# EAGLE design audio_spectrum (EAGLE 8.3.1)
AUTHOR: Samuel Rohrer, Joshua Adkins; REV: E; TITLE: AUDIO SPECTRUM MODULE

## Sheet 1 of 2
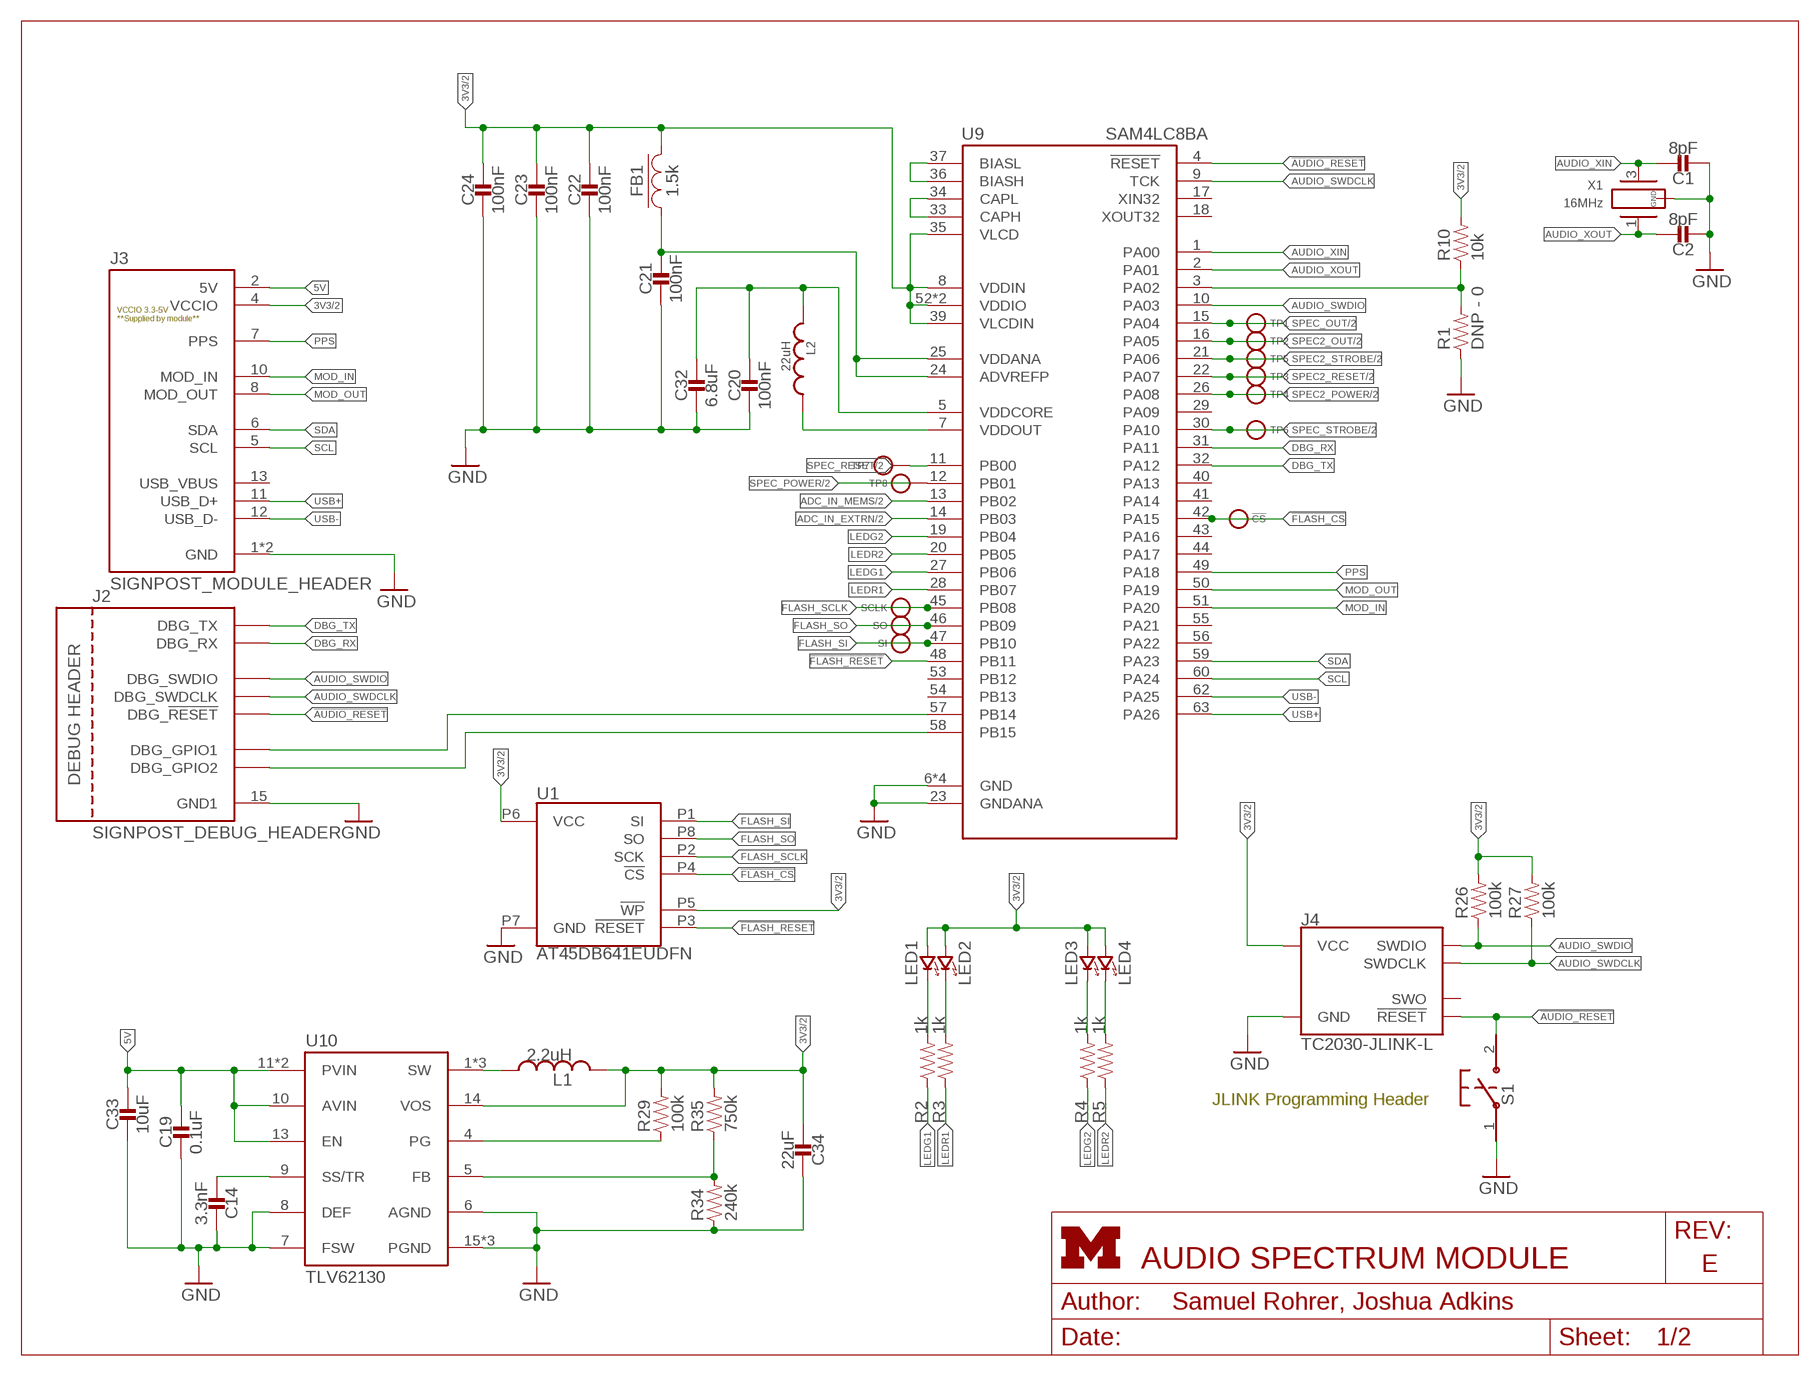
[diagram p0: schematic, sheet 1]
FRAME1 (LETTER_L_UMICH): HEIGHT: 8.5in; WIDTH: 11in

### Parts
!CS  TEST_POINT_0.040IN  [TESTPOINT_0.040IN]
C1  8pF  CAPACITOR0402_CAP  [0402_CAP]
C2  8pF  CAPACITOR0402_CAP  [0402_CAP]
C14  3.3nF  CAPACITOR0603_CAP  [0603_CAP]
C19  0.1uF  CAPACITOR0603_CAP  [0603_CAP]
C20  100nF  CAPACITOR0402_CAP  [0402_CAP]
C21  100nF  CAPACITOR0603_CAP  [0603_CAP]
C22  100nF  CAPACITOR0603_CAP  [0603_CAP]
C23  100nF  CAPACITOR0603_CAP  [0603_CAP]
C24  100nF  CAPACITOR0603_CAP  [0603_CAP]
C32  6.8uF  CAPACITOR0603_CAP  [0603_CAP]
C33  10uF  CAPACITOR0603_CAP  [0603_CAP]
C34  22uF  CAPACITOR0603_CAP  [0603_CAP]
FB1  1.5k  FERRITE_BEAD0402  [0402_CAP]
J2  SIGNPOST_DEBUG_HEADER  [SIGNPOST_DEBUG_HEADER]
J3  SIGNPOST_MODULE_HEADER  [SIGNPOST_MODULE_HEADER]
J4  TC2030-JLINK-L  [TC2030-IDC]
L1  2.2uH  INDUCTORIHL  [IHL-1212BZ-11]
L2  22uH  LHQ3NP  [1212]
LED1  LED0603  [LED-0603]
LED2  LED0603  [LED-0603]
LED3  LED0603  [LED-0603]
LED4  LED0603  [LED-0603]
R1  DNP - 0  RESISTOR0603_RES  [0603-RES]
R2  1k  RESISTOR0603_RES  [0603-RES]
R3  1k  RESISTOR0603_RES  [0603-RES]
R4  1k  RESISTOR0603_RES  [0603-RES]
R5  1k  RESISTOR0603_RES  [0603-RES]
R10  10k  RESISTOR0603_RES  [0603-RES]
R26  100k  RESISTOR0603_RES  [0603-RES]
R27  100k  RESISTOR0603_RES  [0603-RES]
R29  100k  RESISTOR0603_RES  [0603-RES]
R34  240k  RESISTOR0603_RES  [0603-RES]
R35  750k  RESISTOR0603_RES  [0603-RES]
S1  B3U-1000P  [B3U-1000P]
SCLK  TEST_POINT_0.040IN  [TESTPOINT_0.040IN]
SI  TEST_POINT_0.040IN  [TESTPOINT_0.040IN]
SO  TEST_POINT_0.040IN  [TESTPOINT_0.040IN]
TP1  TEST_POINT_0.040IN  [TESTPOINT_0.040IN]
TP2  TEST_POINT_0.040IN  [TESTPOINT_0.040IN]
TP3  TEST_POINT_0.040IN  [TESTPOINT_0.040IN]
TP4  TEST_POINT_0.040IN  [TESTPOINT_0.040IN]
TP5  TEST_POINT_0.040IN  [TESTPOINT_0.040IN]
TP6  TEST_POINT_0.040IN  [TESTPOINT_0.040IN]
TP7  TEST_POINT_0.040IN  [TESTPOINT_0.040IN]
TP8  TEST_POINT_0.040IN  [TESTPOINT_0.040IN]
U1  AT45DB641EUDFN  [UDFN-8-5MMX6MM]
U9  SAM4LC8BA  [QFN-64-9MM]
U10  TLV62130  [TQFN-16/3MM]
X1  16MHz  FH1600015  [FHXXX]

### Nets
3V3: C22.1 C23.1 C24.1 C34.2 FB1.2 J3.4(VCCIO) J4.1(VCC) L1.P$2 LED1.A(ANODE) LED2.A(ANODE) LED3.A(ANODE) LED4.A(ANODE) R10.2 R26.2 R27.2 R29.2 R35.2 U1.P5(!WP) U1.P6(VCC) U9.8(VDDIN) U9.35(VLCD) U9.39(VLCDIN) U9.52(VDDIO) U9.61(VDDIO) U10.14(VOS) ; also sheet 2
3VSWOUT: L1.P$1 U10.1(SW) U10.2(SW) U10.3(SW)
5V: C19.1 C33.1 J3.2(5V) U10.10(AVIN) U10.11(PVIN) U10.12(PVIN) U10.13(EN)
!AUDIO_RESET: J2.20(DBG_!RESET) J4.3(!RESET) S1.2 U9.4(!RESET)
!FLASH_CS: !CS.TESTPOINT U1.P4(!CS) U9.42(PA15)
!FLASH_RESET: U1.P3(!RESET) U9.48(PB11)
ADC_IN_EXTRN: U9.14(PB03) ; also sheet 2
ADC_IN_MEMS: U9.13(PB02) ; also sheet 2
AUDIO_SWDCLK: J2.21(DBG_SWDCLK) J4.4(SWDCLK) R27.1 U9.9(TCK)
AUDIO_SWDIO: J2.22(DBG_SWDIO) J4.2(SWDIO) R26.1 U9.10(PA03)
AUDIO_XIN: C1.1 U9.1(PA00) X1.3
AUDIO_XOUT: C2.1 U9.2(PA01) X1.1
CONTROLLER_BUCK/LDO_N: R1.2 R10.1 U9.3(PA02)
DBG_GPIO1: J2.16(DBG_GPIO1) U9.57(PB14)
DBG_GPIO2: J2.19(DBG_GPIO2) U9.58(PB15)
DBG_RX: J2.18(DBG_RX) U9.31(PA11)
DBG_TX: J2.17(DBG_TX) U9.32(PA12)
FLASH_SCLK: SCLK.TESTPOINT U1.P2(SCK) U9.45(PB08)
FLASH_SI: SI.TESTPOINT U1.P1(SI) U9.47(PB10)
FLASH_SO: SO.TESTPOINT U1.P8(SO) U9.46(PB09)
GND: C1.2 C2.2 C14.1 C19.2 C20.2 C21.2 C22.2 C23.2 C24.2 C32.2 C33.2 C34.1 J2.15(GND1) J3.1(GND) J3.14(GND) J4.5(GND) R1.1 R34.1 S1.1 U1.P7(GND) U9.6(GND) U9.23(GNDANA) U9.38(GND) U9.64(GND) U9.GND U10.6(AGND) U10.7(FSW) U10.8(DEF) U10.15(PGND) U10.16(PGND) U10.GND X1.2(GND) X1.4(GND) ; also sheet 2
LEDG1: R2.1 U9.27(PB06)
LEDG2: R4.1 U9.19(PB04)
LEDR1: R3.1 U9.28(PB07)
LEDR2: R5.1 U9.20(PB05)
MOD_IN: J3.10(MOD_IN) U9.51(PA20)
MOD_OUT: J3.8(MOD_OUT) U9.50(PA19)
N$21: LED1.C(CATHODE) R2.2
N$23: LED2.C(CATHODE) R3.2
N$24: TP8.TESTPOINT U9.12(PB01)
N$25: LED4.C(CATHODE) R5.2
N$29: C20.1 C32.1 L2.P$2 U9.5(VDDCORE)
N$32: C21.1 FB1.1 U9.24(ADVREFP) U9.25(VDDANA)
N$33: LED3.C(CATHODE) R4.2
N$34: C14.2 U10.9(SS/TR)
N$36: R29.1 U10.4(PG)
N$37: R34.2 R35.1 U10.5(FB)
N$44: L2.P$1 U9.7(VDDOUT)
N$53: U9.36(BIASH) U9.37(BIASL)
N$54: U9.33(CAPH) U9.34(CAPL)
PPS: J3.7(PPS) U9.49(PA18)
SCL: J3.5(SCL) U9.60(PA24)
SDA: J3.6(SDA) U9.59(PA23)
SPEC2_OUT: TP2.TESTPOINT U9.16(PA05) ; also sheet 2
SPEC2_POWER: TP4.TESTPOINT U9.26(PA08) ; also sheet 2
SPEC2_RESET: TP3.TESTPOINT U9.22(PA07) ; also sheet 2
SPEC2_STROBE: TP5.TESTPOINT U9.21(PA06) ; also sheet 2
SPEC_OUT: TP1.TESTPOINT U9.15(PA04) ; also sheet 2
SPEC_RESET: TP7.TESTPOINT U9.11(PB00) ; also sheet 2
SPEC_STROBE: TP6.TESTPOINT U9.30(PA10) ; also sheet 2
USB+: J3.11(USB_D+) U9.63(PA26)
USB-: J3.12(USB_D-) U9.62(PA25)
Unconnected: J3.13(USB_VBUS) J4.6(SWO) U9.17(XIN32) U9.18(XOUT32) U9.29(PA09) U9.40(PA13) U9.41(PA14) U9.43(PA16) U9.44(PA17) U9.53(PB12) U9.54(PB13) U9.55(PA21) U9.56(PA22)

### Notes on the sheet
- JLINK Programming Header

## Sheet 2 of 2
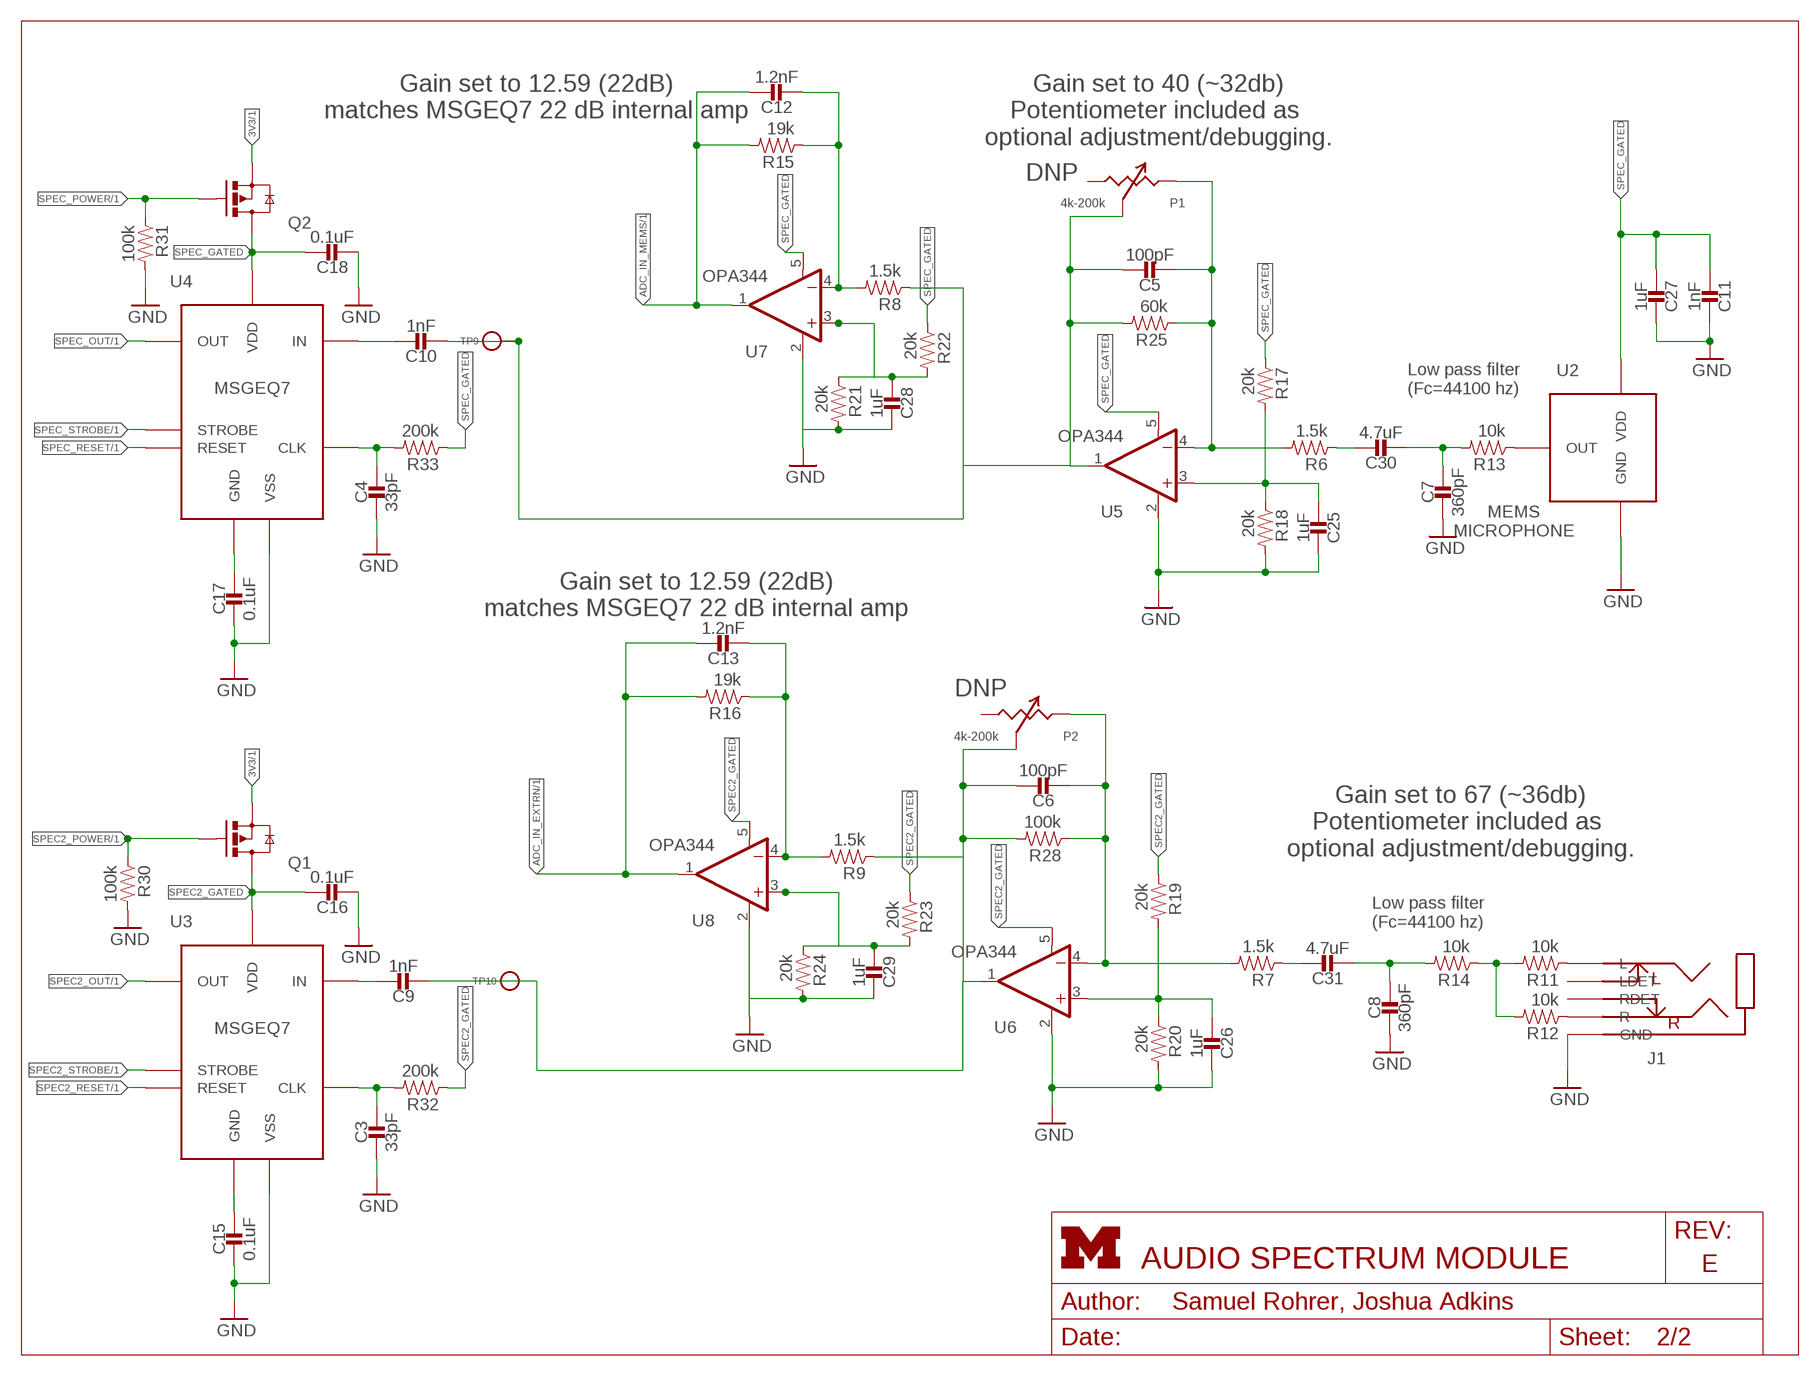
[diagram p1: schematic, sheet 2]
FRAME2 (LETTER_L_UMICH): HEIGHT: 8.5in; WIDTH: 11in

### Parts
C3  33pF  CAPACITOR0603_CAP  [0603_CAP]
C4  33pF  CAPACITOR0603_CAP  [0603_CAP]
C5  100pF  CAPACITOR0603_CAP  [0603_CAP]
C6  100pF  CAPACITOR0603_CAP  [0603_CAP]
C7  360pF  CAPACITOR0603_CAP  [0603_CAP]
C8  360pF  CAPACITOR0603_CAP  [0603_CAP]
C9  1nF  CAPACITOR0603_CAP  [0603_CAP]
C10  1nF  CAPACITOR0603_CAP  [0603_CAP]
C11  1nF  CAPACITOR0603_CAP  [0603_CAP]
C12  1.2nF  CAPACITOR0603_CAP  [0603_CAP]
C13  1.2nF  CAPACITOR0603_CAP  [0603_CAP]
C15  0.1uF  CAPACITOR0603_CAP  [0603_CAP]
C16  0.1uF  CAPACITOR0603_CAP  [0603_CAP]
C17  0.1uF  CAPACITOR0603_CAP  [0603_CAP]
C18  0.1uF  CAPACITOR0603_CAP  [0603_CAP]
C25  1uF  CAPACITOR0603_CAP  [0603_CAP]
C26  1uF  CAPACITOR0603_CAP  [0603_CAP]
C27  1uF  CAPACITOR0603_CAP  [0603_CAP]
C28  1uF  CAPACITOR0603_CAP  [0603_CAP]
C29  1uF  CAPACITOR0603_CAP  [0603_CAP]
C30  4.7uF  CAPACITOR0603_CAP  [0603_CAP]
C31  4.7uF  CAPACITOR0603_CAP  [0603_CAP]
J1  AUDIO-JACK-VERTICAL  [AUDIO-JACK-VERTICAL]
P1  4k-200k  POTTC33X  [TC33X-2]
P2  4k-200k  POTTC33X  [TC33X-2]
Q1  NX3008PBK  [SOT23-3]
Q2  NX3008PBK  [SOT23-3]
R6  1.5k  RESISTOR0603_RES  [0603-RES]
R7  1.5k  RESISTOR0603_RES  [0603-RES]
R8  1.5k  RESISTOR0603_RES  [0603-RES]
R9  1.5k  RESISTOR0603_RES  [0603-RES]
R11  10k  RESISTOR0603_RES  [0603-RES]
R12  10k  RESISTOR0603_RES  [0603-RES]
R13  10k  RESISTOR0603_RES  [0603-RES]
R14  10k  RESISTOR0603_RES  [0603-RES]
R15  19k  RESISTOR0603_RES  [0603-RES]
R16  19k  RESISTOR0603_RES  [0603-RES]
R17  20k  RESISTOR0603_RES  [0603-RES]
R18  20k  RESISTOR0603_RES  [0603-RES]
R19  20k  RESISTOR0603_RES  [0603-RES]
R20  20k  RESISTOR0603_RES  [0603-RES]
R21  20k  RESISTOR0603_RES  [0603-RES]
R22  20k  RESISTOR0603_RES  [0603-RES]
R23  20k  RESISTOR0603_RES  [0603-RES]
R24  20k  RESISTOR0603_RES  [0603-RES]
R25  60k  RESISTOR0603_RES  [0603-RES]
R28  100k  RESISTOR0603_RES  [0603-RES]
R30  100k  RESISTOR0603_RES  [0603-RES]
R31  100k  RESISTOR0603_RES  [0603-RES]
R32  200k  RESISTOR0603_RES  [0603-RES]
R33  200k  RESISTOR0603_RES  [0603-RES]
TP9  TEST_POINT_0.040IN  [TESTPOINT_0.040IN]
TP10  TEST_POINT_0.040IN  [TESTPOINT_0.040IN]
U2  MP23AB02B  [MP23AB02B]
U3  MSGEQ7  [DIP-8]
U4  MSGEQ7  [DIP-8]
U5  OPA344  [SOT23-5]
U6  OPA344  [SOT23-5]
U7  OPA344  [SOT23-5]
U8  OPA344  [SOT23-5]

### Nets
3V3: Q1.2(S) Q2.2(S) ; also sheet 1
ADC_IN_EXTRN: C13.1 R16.2 U8.1(OUT) ; also sheet 1
ADC_IN_MEMS: C12.1 R15.2 U7.1(OUT) ; also sheet 1
GND: C3.2 C4.2 C7.2 C8.2 C11.1 C15.2 C16.2 C17.2 C18.2 C25.1 C26.1 C27.1 C28.1 C29.1 J1.5(GND) R18.2 R20.2 R21.2 R24.2 R30.2 R31.2 U2.3(GND) U3.2(VSS) U4.2(VSS) U5.2(V-) U6.2(V-) U7.2(V-) U8.2(V-) ; also sheet 1
N87: C6.1 C9.2 P2.3(W) R9.1 R28.2 TP10.TESTPOINT U6.1(OUT)
N90: C5.1 C10.2 P1.3(W) R8.1 R25.2 TP9.TESTPOINT U5.1(OUT)
N$1: C15.1 U3.6(GND)
N$2: C3.1 R32.2 U3.8(CLK)
N$3: C9.1 U3.5(IN)
N$5: C7.1 C30.2 R13.2
N$6: C4.1 R33.2 U4.8(CLK)
N$7: C10.1 U4.5(IN)
N$8: C13.2 R9.2 R16.1 U8.4(-IN)
N$9: C25.2 R17.2 R18.1 U5.3(+IN)
N$10: R11.2 R12.2 R14.1
N$11: C26.2 R19.2 R20.1 U6.3(+IN)
N$12: C5.2 P1.2(CW) R6.2 R25.1 U5.4(-IN)
N$13: C30.1 R6.1
N$14: C6.2 P2.2(CW) R7.2 R28.1 U6.4(-IN)
N$15: C31.1 R7.1
N$16: J1.1(R) R12.1
N$17: J1.4(L) R11.1
N$18: R13.1 U2.1(OUT)
N$19: C17.1 U4.6(GND)
N$20: C8.1 C31.2 R14.2
N$26: C12.2 R8.2 R15.1 U7.4(-IN)
N$27: C28.2 R21.1 R22.2 U7.3(+IN)
N$28: C29.2 R23.2 R24.1 U8.3(+IN)
SPEC2_GATED: C16.1 Q1.3(D) R19.1 R23.1 R32.1 U3.1(VDD) U6.5(V+) U8.5(V+)
SPEC2_OUT: U3.3(OUT) ; also sheet 1
SPEC2_POWER: Q1.1(G) R30.1 ; also sheet 1
SPEC2_RESET: U3.7(RESET) ; also sheet 1
SPEC2_STROBE: U3.4(STROBE) ; also sheet 1
SPEC_GATED: C11.2 C18.1 C27.2 Q2.3(D) R17.1 R22.1 R33.1 U2.2(VDD) U4.1(VDD) U5.5(V+) U7.5(V+)
SPEC_OUT: U4.3(OUT) ; also sheet 1
SPEC_POWER: Q2.1(G) R31.1 ; also sheet 1
SPEC_RESET: U4.7(RESET) ; also sheet 1
SPEC_STROBE: U4.4(STROBE) ; also sheet 1
Unconnected: J1.2(RDET) J1.3(LDET) P1.1(CCW) P2.1(CCW)

### Notes on the sheet
- Gain set to 12.59 (22dB)
  matches MSGEQ7 22 dB internal amp
- Gain set to 40 (~32db)
  Potentiometer included as 
  optional adjustment/debugging.
- DNP
- Low pass filter 
  (Fc=44100 hz)
- Gain set to 12.59 (22dB)
  matches MSGEQ7 22 dB internal amp
- DNP
- Gain set to 67 (~36db)
  Potentiometer included as 
  optional adjustment/debugging.
- Low pass filter 
  (Fc=44100 hz)

## Library data of the parts
!CS SCLK SI SO TP1-TP10 = headers:TEST_POINT_0.040IN: 0.040in Test Point; DIGIKEY: 5001K-ND
C1 C2 = passives:CAPACITOR: SMD Capacitor; DIGIKEY: 490-8230-1-ND; MANUFACTURER: Murata; MPN: GRM1555C1H8R0BA01D
C3 C4 = passives:CAPACITOR: SMD Capacitor; DIGIKEY: 490-1415-1-ND; MANUFACTURER: Murata; MPN: GRM1885C1H330JA01D
C5 C6 = passives:CAPACITOR: SMD Capacitor; DIGIKEY: 490-1427-1-ND; MANUFACTURER: Murata; MPN: GRM1885C1H101JA01D
C7 C8 = passives:CAPACITOR: SMD Capacitor; DIGIKEY: 490-1440-1-ND; MANUFACTURER: Murata; MPN: GRM1885C1H361JA01D
C9-C11 = passives:CAPACITOR: SMD Capacitor; DIGIKEY: 490-1494-1-ND; MANUFACTURER: Murata; MPN: GRM188R71H102KA01D
C12 C13 = passives:CAPACITOR: SMD Capacitor; DIGIKEY: 490-13298-1-ND; MANUFACTURER: Murata; MPN: GCM1885C1H122JA16D
C14 = passives:CAPACITOR: SMD Capacitor; DIGIKEY: 490-1503-1-ND; MANUFACTURER: Murata; MPN: GRM188R71H332KA01D
C15-C19 C21-C24 = passives:CAPACITOR: SMD Capacitor; DIGIKEY: 490-1532-1-ND; MANUFACTURER: Murata; MPN: GRM188R71C104KA01D
C20 = passives:CAPACITOR: SMD Capacitor; DIGIKEY: 490-10777-1-ND; MANUFACTURER: Murata; MPN: GRM155R71A104JA01D
C25-C29 = passives:CAPACITOR: SMD Capacitor; DIGIKEY: 490-1536-1-ND; MANUFACTURER: Murata; MPN: GRM188R61C105KA93D
C30 C31 = passives:CAPACITOR: SMD Capacitor; DIGIKEY: 490-3297-1-ND; MANUFACTURER: Murata; MPN: GRM188R60J475KE19D
C32 = passives:CAPACITOR: SMD Capacitor; DIGIKEY: 445-7484-1-ND; MANUFACTURER: TDk; MPN: C1608X5R1A685K080AC
C33 = passives:CAPACITOR: SMD Capacitor; DIGIKEY: 490-6405-1-ND; MANUFACTURER: Murata; MPN: GRM188R60J106ME47J
C34 = passives:CAPACITOR: SMD Capacitor; DIGIKEY: 490-13241-1-ND; MANUFACTURER: Murata; MPN: GRM186R60J226ME15D
FB1 = passives:FERRITE_BEAD; DIGIKEY: 490-5216-1-ND; MANUFACTURER: Murata; MPN: BLM18HE152SN1D
J1 = connector:AUDIO-JACK-VERTICAL: A vertical audio jack; MANUFACTURER: Kycon; MOUSER: 806-STX-3790-5N; MPN: STX-3790-5N
J2 = signpost:SIGNPOST_DEBUG_HEADER: The 8 Pin signpost Debug Header; DIGIKEY: S2221EC-04-ND; MANUFACTURER: Sullins Connector; MPN: PRPC004DFBN-RC
J3 = signpost:SIGNPOST_MODULE_HEADER: The 14 pin signpost module header; DIGIKEY: S9170-ND; MANUFACTURER: Sullins Connector; MPN: SBH11-PBPC-D07-ST-BK
J4 = connector:TC2030-JLINK
L1 = passives:INDUCTOR: A very specific inductor; DIGIKEY: 541-1322-1-ND; MANUFACTURER: Vishay Dale; MPN: IHLP1212BZER2R2M11
L2 = signpost:LHQ3NP: LHQ3NP Inductor; DIGIKEY: 490-5350-1-ND; MANUFACTURER: Murata; MPN: LQH3NPN220MJ0L
LED1 LED3 = leds:LED: LED; DIGIKEY: 160-1446-1-ND; MANUFACTURER: Lite-On; MPN: LTST-C191KGKT
LED2 LED4 = leds:LED: LED; DIGIKEY: 160-1447-1-ND; MANUFACTURER: Lite-On; MPN: LTST-C191KRKT
P1 P2 = pots:POT: Potentiometer; DIGIKEY: TC33X-2-204ECT-ND
Q1 Q2 = fets:NX3008PBK: MOSFET - P Channel; DIGIKEY: 568-10499-1-ND; MANUFACTURER: Nexperia; MOUSER: 771-NX3008PBK,215; MPN: NX3008PBK,215; NEWARK: 74T4665
R1 = passives:RESISTOR: Resistor Basic schematic elements and footprints for 0603, 1206, and PTH resistors.; DIGIKEY: 1276-3431-1-ND; MANUFACTURER: Samsung; MPN: RC1005F103CS
R2 = passives:RESISTOR: Resistor Basic schematic elements and footprints for 0603, 1206, and PTH resistors.; DIGIKEY: RHM1.0KDCT-N; MANUFACTURER: Murata; MPN: ESR03EZPJ102
R3-R5 = passives:RESISTOR: Resistor Basic schematic elements and footprints for 0603, 1206, and PTH resistors.; DIGIKEY: RHM1.0KDCT-ND; MANUFACTURER: Murata; MPN: ESR03EZPJ102
R6-R9 = passives:RESISTOR: Resistor Basic schematic elements and footprints for 0603, 1206, and PTH resistors.; DIGIKEY: RHM1.5KCGCT-ND; MANUFACTURER: Rohm; MPN: MCR03ERTJ152
R10-R14 = passives:RESISTOR: Resistor Basic schematic elements and footprints for 0603, 1206, and PTH resistors.; DIGIKEY: RHM10.0KHCT-ND; MANUFACTURER: Rohm; MPN: MCR03EZPFX1002
R15 R16 = passives:RESISTOR: Resistor Basic schematic elements and footprints for 0603, 1206, and PTH resistors.; DIGIKEY: RHM19.1KCFCT-ND; MANUFACTURER: Rohm; MPN: MCR03ERTF1912
R17-R24 = passives:RESISTOR: Resistor Basic schematic elements and footprints for 0603, 1206, and PTH resistors.; DIGIKEY: RHM20KCGCT-ND; MANUFACTURER: Rohm; MPN: MCR03ERTJ203
R25 = passives:RESISTOR: Resistor Basic schematic elements and footprints for 0603, 1206, and PTH resistors.; DIGIKEY: RHM60.4KCLCT-ND; MANUFACTURER: Rohm; MPN: MCR03ERTF6042
R26-R31 = passives:RESISTOR: Resistor Basic schematic elements and footprints for 0603, 1206, and PTH resistors.; DIGIKEY: RHM100KCGCT-ND; MANUFACTURER: Rohm; MPN: MCR03ERTJ104
R32 R33 = passives:RESISTOR: Resistor Basic schematic elements and footprints for 0603, 1206, and PTH resistors.; DIGIKEY: RHM200KCFCT-ND; MANUFACTURER: Rohm; MPN: MCR03ERTF2003
R34 = passives:RESISTOR: Resistor Basic schematic elements and footprints for 0603, 1206, and PTH resistors.; DIGIKEY: RHM240KCFCT-ND; MANUFACTURER: Rohm; MPN: RHM240KCFCT-ND
R35 = passives:RESISTOR: Resistor Basic schematic elements and footprints for 0603, 1206, and PTH resistors.; DIGIKEY: RHM750KCFCT-ND; MANUFACTURER: Rohm; MPN: MCR03ERTF7503
S1 = switches:B3U: Switch; DIGIKEY: SW1020CT-ND; MANUFACTURER: Omron; MPN: B3U-1000P
U1 = chips:AT45DB641E: 64 Mbit flash memory; DIGIKEY: AT45DB641E-MHN-TCT-ND; MANUFACTURER: Adesto; MPN: AT45DB641E-MHN-T
U2 = chips:MP23AB02B: A pretty normal mems microphone; DIGIKEY: 497-14947-1-ND; MANUFACTURER: STMicroelectronics; MPN: MP23AB02BTR
U3 U4 = chips:MSGEQ7: A CMOS spectrum analyzer; DIGIKEY: 1568-1335-ND; MANUFACTURER: Sparkfun Electronics; MPN: COM-10468
U5-U8 = SparkFun-AnalogIC:OPA344: Single gate rail-to-rail output op-amp. Inputs extend 300mV past rails.; DIGIKEY: OPA344NACT-ND; MANUFACTURER: Texax Instruments; MPN: OPA344NA/250
U9 = chips:SAM4LC8BA: SAM4L Microcontroller. 64QFN Package. 512 Flash.; DIGIKEY: ATSAM4LC8BA-MURCT-ND; MANUFACTURER: Microchip; MPN: ATSAM4LC8BA-MUR
U10 = chips:TLV62130: High Efficient 3A switching step-down regulator. 1V-5V out, 4V-17V in.; DIGIKEY: 296-35978-1-ND; MANUFACTURER: Texas Instruments; MPN: TLV62130RGTR
X1 = crystals:FH1600015: Pericom Type FH 16 MHz 2.5 x 2.0 mm; DIGIKEY: FH1600015CT-ND; MANUFACTURER: Diodes Incorporated; MPN: FH1600015

## Board
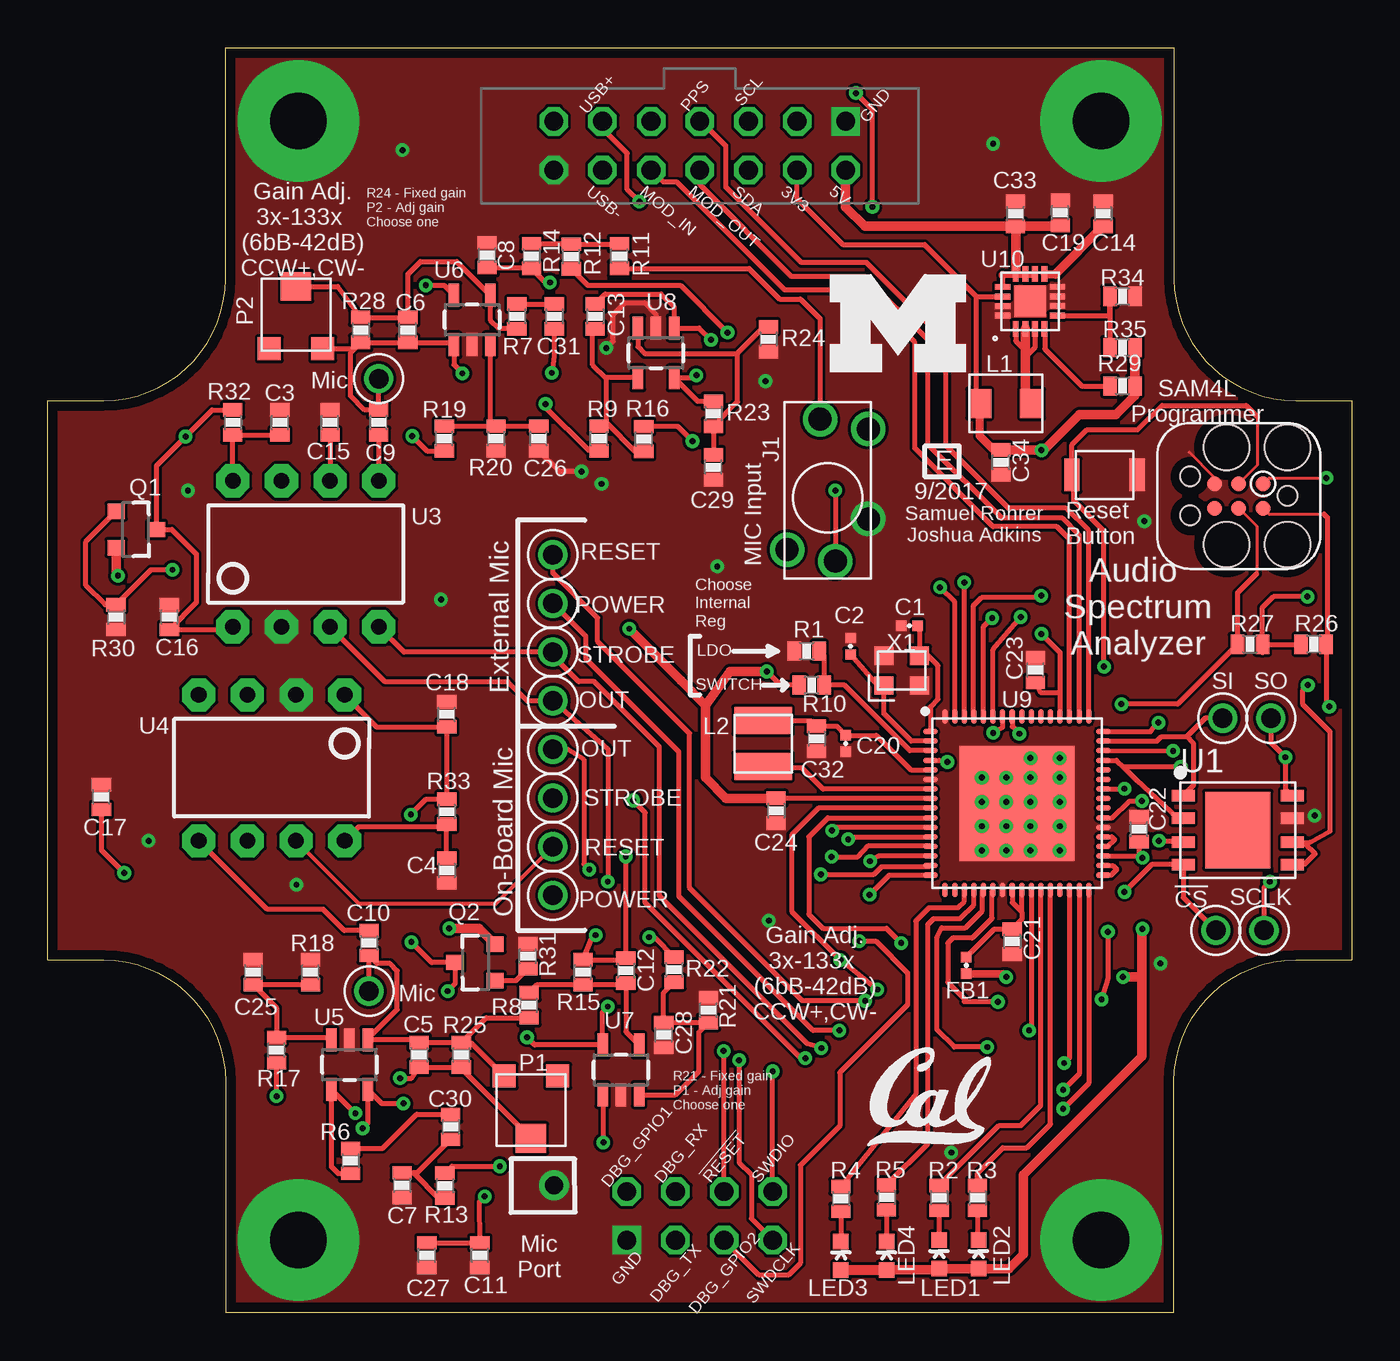
[diagram p2: board, top side]
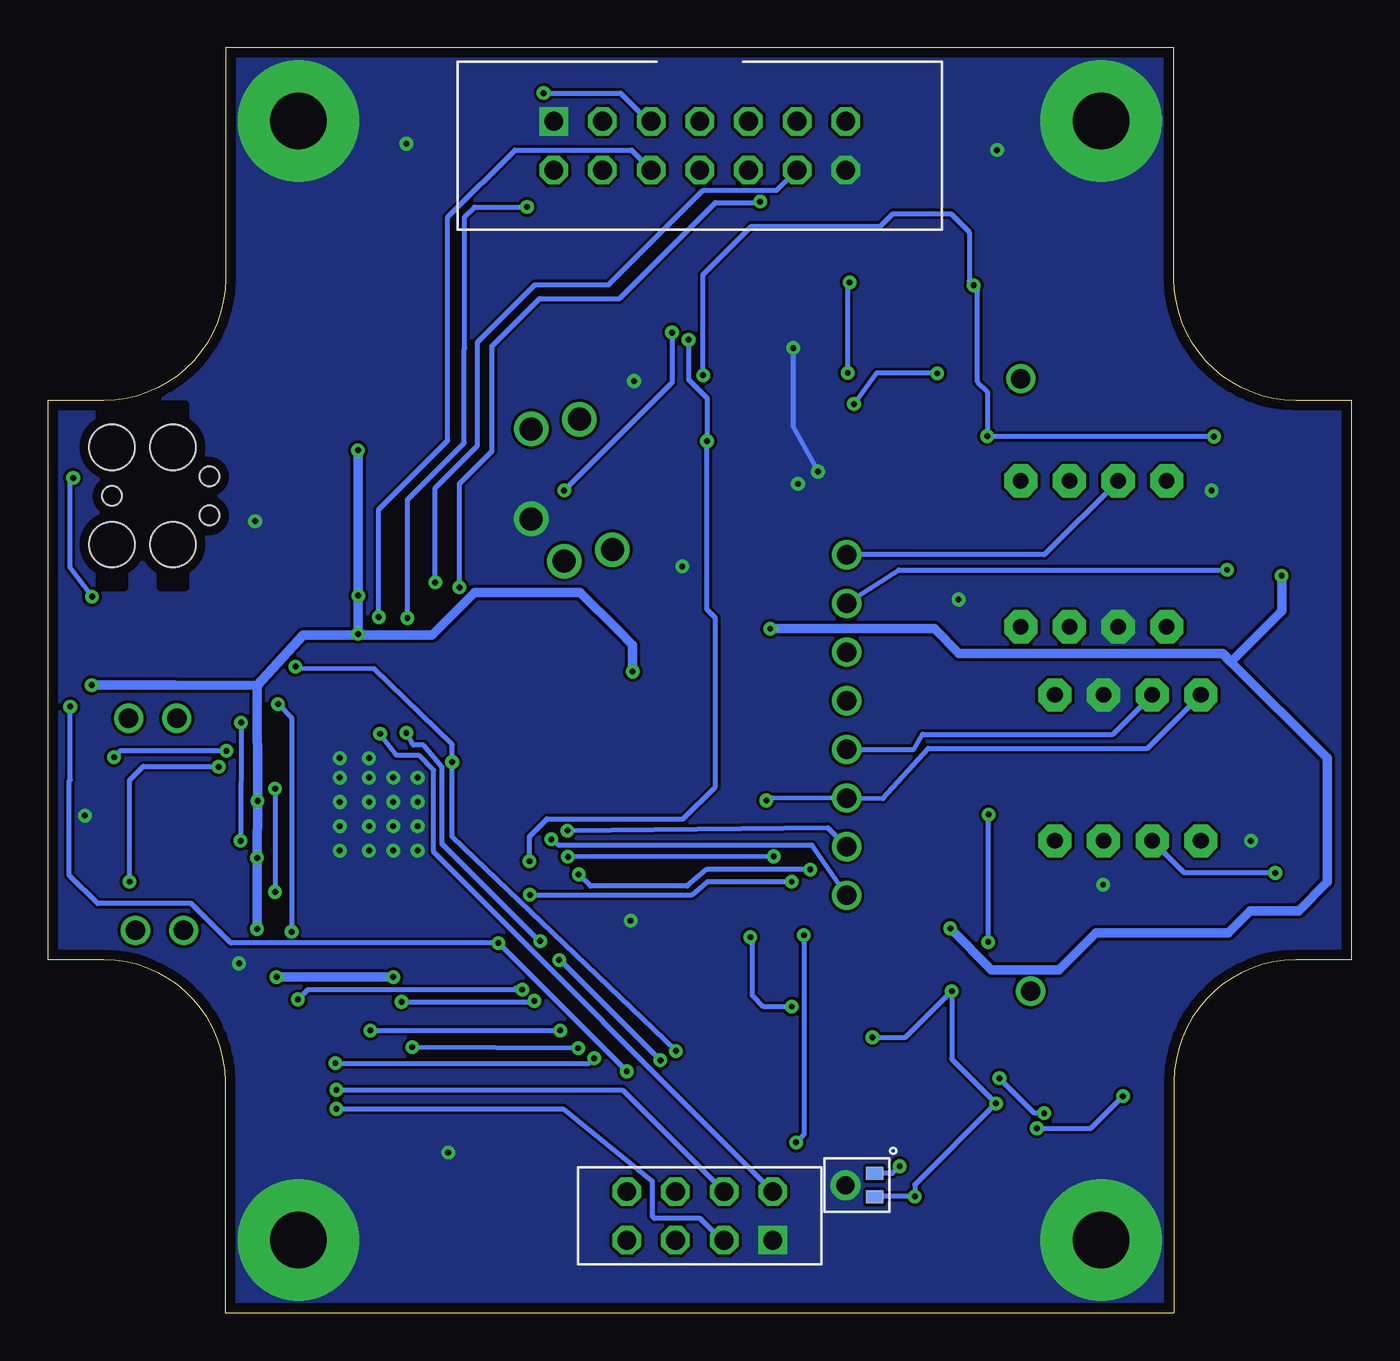
[diagram p3: board, bottom side, seen from below]

Size 68.07 x 66.04 mm. Coordinates in mm from the lower left corner, seen from the top.
Outline: 9.27,66.04 58.8,66.04 58.8,53.98 arc90 65.15,47.62 68.07,47.62 68.07,18.41 65.15,18.41 arc90 58.8,12.07 58.8,0 9.27,0 9.27,12.07 arc90 2.92,18.41 0,18.41 0,47.62 2.92,47.62 arc90 9.27,53.98 9.27,66.04
Copper layers (1*16): Top 0.0178mm / dielectric 12mil / Bottom 0.0178mm
Design rules "quickturn_co_kr_1oz *": minimum track width 6mil, minimum drill 8mil, track to track 4mil, track to pad 4mil, pad to pad 4mil, via to via 4mil, smd to smd 4mil, copper to edge 20mil, drill to drill 16mil, minimum pad ring 8mil, minimum via ring 8mil, stop-mask expansion 3mil, vias tented up to drill 50mil, thermal gap 10mil

### Footprints (pad centres in the part's own frame; a part is rotated, then mirrored left to right if it is on the bottom)
TESTPOINT_0.040IN = drill 1.016: TESTPOINT 0,0
0402_CAP = smd 0.536 x 0.546: 1 -0.433,0; 2 0.433,0
0603_CAP = smd 0.7 x 1: 1 -0.65,0; 2 0.65,0
AUDIO-JACK-VERTICAL = drill 1.2: 1 -3.3,-0.4; 2 -2.7,2.12; 3 3.6,-2.12; 4 4.1,0.4; 5 -1.1,-2.12
SIGNPOST_DEBUG_HEADER = drill 0.991 square: 15 -3.81,-1.27 | drill 0.991 octagon: 16 -3.81,1.27; 17 -1.27,-1.27; 18 -1.27,1.27; 19 1.27,-1.27; 20 1.27,1.27; 21 3.81,-1.27; 22 3.81,1.27
SIGNPOST_MODULE_HEADER = drill 0.991 square: 1 7.62,1.27 | drill 0.991 octagon: 2 7.62,-1.27; 3 5.08,1.27; 4 5.08,-1.27; 5 2.54,1.27; 6 2.54,-1.27; 7 0,1.27; 8 0,-1.27; 9 -2.54,1.27; 10 -2.54,-1.27; 11 -5.08,1.27; 12 -5.08,-1.27; 13 -7.62,1.27; 14 -7.62,-1.27
TC2030-IDC = smd 0.787 x 0.787: 1 -1.27,-0.635; 2 -1.27,0.635; 3 0,-0.635; 4 0,0.635; 5 1.27,-0.635; 6 1.27,0.635 | hole 2.375: -2.54,2.54; 0.635,2.54; 0.635,-2.54; -2.54,-2.54 | hole 1.016: -2.54,0; 2.54,1.016; 2.54,-1.016
IHL-1212BZ-11 = smd 1.2 x 1.5: P$1 -1.35,0; P$2 1.35,0
1212 = smd 1.4 x 3: P$1 -1.2,0; P$2 1.2,0
LED-0603 = smd 0.8 x 0.8: A 0,-0.75; C 0,0.75
TC33X-2 = smd 1.2 x 1.2: 1 -1.4,-2.5; 3 1.4,-2.5 | smd 1.6 x 1.5: 2 0,0.75
SOT23-3 = smd 0.8 x 0.9: 1 -0.95,-1; 2 0.95,-1; 3 0,1.1
0603-RES = smd 0.7 x 1: 1 -0.65,0; 2 0.65,0
B3U-1000P = smd 0.8 x 1.7: 1 -1.7,0; 2 1.7,0
UDFN-8-5MMX6MM = smd 1.2 x 0.6: P1 -2.85,1.8; P2 -2.85,0.635; P3 -2.85,-0.635; P4 -2.85,-1.8; P5 2.85,-1.8; P6 2.85,-0.635; P7 2.85,0.635; P8 2.85,1.8 | smd 3.4 x 4: P$9 0,0
MP23AB02B = smd 0.68 x 0.9: 1 -0.61,0.925; 2 0.61,0.925 | drill 0.95 pad 1.55: 3 0,-0.595
DIP-8 = drill 0.813 pad 1.727 octagon: 1 -3.81,-3.81; 2 -1.27,-3.81; 3 1.27,-3.81; 4 3.81,-3.81; 5 3.81,3.81; 6 1.27,3.81; 7 -1.27,3.81; 8 -3.81,3.81
SOT23-5 = smd 0.55 x 1.2: 1 -0.95,-1.3; 2 0,-1.3; 3 0.95,-1.3; 4 0.95,1.3; 5 -0.95,1.3
QFN-64-9MM = smd 0.75 x 0.28: 1 -4.525,3.75; 2 -4.525,3.25; 3 -4.525,2.75; 4 -4.525,2.25; 5 -4.525,1.75; 6 -4.525,1.25; 7 -4.525,0.75; 8 -4.525,0.25; 9 -4.525,-0.25; 10 -4.525,-0.75; 11 -4.525,-1.25; 12 -4.525,-1.75; 13 -4.525,-2.25; 14 -4.525,-2.75; 15 -4.525,-3.25; 16 -4.525,-3.75; 33 4.525,-3.75; 34 4.525,-3.25; 35 4.525,-2.75; 36 4.525,-2.25; 37 4.525,-1.75; 38 4.525,-1.25; 39 4.525,-0.75; 40 4.525,-0.25; 41 4.525,0.25; 42 4.525,0.75; 43 4.525,1.25; 44 4.525,1.75; 45 4.525,2.25; 46 4.525,2.75; 47 4.525,3.25; 48 4.525,3.75 | smd 0.28 x 0.75: 17 -3.75,-4.525; 18 -3.25,-4.525; 19 -2.75,-4.525; 20 -2.25,-4.525; 21 -1.75,-4.525; 22 -1.25,-4.525; 23 -0.75,-4.525; 24 -0.25,-4.525; 25 0.25,-4.525; 26 0.75,-4.525; 27 1.25,-4.525; 28 1.75,-4.525; 29 2.25,-4.525; 30 2.75,-4.525; 31 3.25,-4.525; 32 3.75,-4.525; 49 3.75,4.525; 50 3.25,4.525; 51 2.75,4.525; 52 2.25,4.525; 53 1.75,4.525; 54 1.25,4.525; 55 0.75,4.525; 56 0.25,4.525; 57 -0.25,4.525; 58 -0.75,4.525; 59 -1.25,4.525; 60 -1.75,4.525; 61 -2.25,4.525; 62 -2.75,4.525; 63 -3.25,4.525; 64 -3.75,4.525 | smd 6 x 6: GND 0,0
TQFN-16/3MM = smd 0.3 x 0.8: 1 -0.75,-1.43; 2 -0.25,-1.43; 3 0.25,-1.43; 4 0.75,-1.43; 9 0.75,1.43; 10 0.25,1.43; 11 -0.25,1.43; 12 -0.75,1.43 | smd 0.8 x 0.3: 5 1.43,-0.75; 6 1.43,-0.25; 7 1.43,0.25; 8 1.43,0.75; 13 -1.43,0.75; 14 -1.43,0.25; 15 -1.43,-0.25; 16 -1.43,-0.75 | smd 1.63 x 1.63: GND 0,0
FHXXX = smd 1 x 0.95: 1 -0.925,-0.775; 2 0.925,-0.775; 3 0.925,0.775; 4 -0.925,0.775

### Placement (x,y rotation side)
!CS  60.99,19.96 0 top
C1  44.98,35.86 180 top
C2  41.91,34.8 90 top
C3  12.12,46.48 90 top
C4  20.83,23.09 270 top
C5  19.38,13.46 270 top
C6  18.8,51.31 90 top
C7  18.49,6.65 270 top
C8  22.94,55.22 90 top
C9  17.27,46.48 90 top
C10  16.76,19.3 270 top
C11  22.56,3 90 top
C12  30.18,17.86 270 top
C13  28.57,52.02 270 top
C14  55.09,57.38 270 top
C15  14.73,46.48 90 top
C16  6.35,36.32 90 top
C17  2.79,26.92 90 top
C18  20.83,31.24 90 top
C19  52.86,57.43 90 top
C20  41.66,29.72 270 top
C21  50.34,19.38 270 top
C22  56.97,25.25 90 top
C23  51.56,33.55 90 top
C24  38.02,26.21 270 top
C25  10.72,17.78 270 top
C26  25.63,45.64 90 top
C27  19.79,3 90 top
C28  32.16,14.5 90 top
C29  34.75,44.15 90 top
C30  21.03,9.7 270 top
C31  26.44,52.02 270 top
C32  40.13,29.97 270 top
C33  50.52,57.38 90 top
C34  49.76,44.4 90 top
FB1  47.96,18.14 270 top
J1  40.72,42.55 90 top
J2  34.04,5.05 0 top
J3  34.04,60.93 0 top
J4  62.18,42.65 180 top
L1  50.01,47.47 180 top
L2  37.34,29.72 90 top
LED1  46.53,3.05 0 top
LED2  48.59,3.05 0 top
LED3  41.4,2.97 0 top
LED4  43.79,2.97 0 top
P1  25.22,9.86 180 top
P2  12.95,52.83 0 top
Q1  4.57,40.89 270 top
Q2  22.35,18.29 90 top
R1  39.62,34.54 0 top
R2  46.53,5.99 270 top
R3  48.54,5.99 270 top
R4  41.4,5.94 270 top
R5  43.79,6.02 270 top
R6  15.8,7.92 270 top
R7  24.49,52.02 270 top
R8  25.12,16.05 90 top
R9  28.78,45.64 90 top
R10  39.88,32.77 180 top
R11  29.84,55.17 90 top
R12  27.33,55.14 90 top
R13  20.73,6.63 270 top
R14  25.25,55.17 270 top
R15  27.94,17.78 90 top
R16  31.12,45.62 90 top
R17  11.94,13.72 90 top
R18  13.72,17.78 90 top
R19  20.7,45.64 90 top
R20  23.39,45.64 270 top
R21  34.49,15.8 90 top
R22  32.69,17.91 270 top
R23  34.75,46.94 270 top
R24  37.62,50.83 270 top
R25  21.59,13.46 90 top
R26  66.09,34.9 180 top
R27  62.76,34.9 0 top
R28  16.33,51.31 270 top
R29  56.11,48.39 0 top
R30  3.56,36.32 270 top
R31  25.07,18.62 90 top
R32  9.65,46.48 270 top
R33  20.83,26.16 270 top
R34  56.11,53.06 180 top
R35  56.11,50.39 0 top
S1  55.17,43.74 180 top
SCLK  63.5,19.96 0 top
SI  61.34,31.04 0 top
SO  63.86,31.04 0 top
TP1  26.37,29.41 0 top
TP2  26.37,31.95 0 top
TP3  26.37,39.57 0 top
TP4  26.37,37.03 0 top
TP5  26.37,34.49 0 top
TP6  26.37,26.87 0 top
TP7  26.37,24.33 0 top
TP8  26.37,21.79 0 top
TP9  16.76,16.79 0 top
TP10  17.27,48.77 0 top
U1  62.13,25.2 0 top
U2  25.83,6.65 270 bottom
U3  13.46,39.62 0 top
U4  11.68,28.45 180 top
U5  15.75,12.95 180 top
U6  22.15,51.84 0 top
U7  29.92,12.67 0 top
U8  31.75,50.11 180 top
U9  50.6,26.59 0 top
U10  51.28,52.81 0 top
U$1  [UMICH_SOLID_200MIL]  40.84,49.12 0 top
U$2  [UCB_CAL_200MIL]  42.8,8.71 0 top
X1  44.58,33.53 0 top

### Tracks (layer width: path | path; a pad name or v marks a point on that pad's centre or on a via)
3V3  (via drill 0.3)
  Top 0.152: J4.1 63.75,43.59 v66.75,43.59
  Top 0.254: 48.49,53.06 U10.14 | L1.P$2 48.49,47.47 48.49,53.06 | U9.61 48.34,31.13 48.34,36.93 48.74,37.34 51.77,37.34 v51.87,37.44 | 52.83,31.13 U9.52 52.85,32.38 | R10.2 38.25,32.77 v37.54,33.48 | C34.2 50.05,45.03 | 52.85,32.38 52.85,34.48 v51.88,35.44 | 55.14,23.82 U9.35 57.09,23.84 v57.15,23.75 56.97,23.93 C22.1 | v57.12,26.72 56.48,26.71 55.56,25.84 U9.39 | U9.8 38.02,26.84 | U1.P5 65.64,23.42 66.17,23.98 65.66,24.49 U1.P6 65.89,24.56 66.95,25.15 66.95,30.33 65.53,31.75 65.53,32.51 v65.79,32.77 | LED4.A 41.88,2.25 | 57.12,20.02 v57.15,20.04 | 48.49,53.06 45.77,55.78 41.5,55.78 39.12,58.17 J3.4 | v65.76,37.39 63.98,37.39 63.41,36.82 R27.2 | 3.57,38.57 v3.66,38.48 | C23.1 51.83,32.38 52.85,32.38 | 46.84,2.25 LED1.A | 50,17.49 v50.04,17.53 49.86,17.7 | R29.2 56.74,48.37 56.74,47.88 | 50.02,45.06 51.92,45.06 51.97,45.01 | R27.2 63.41,34.46 | 50.93,4.56 50.93,4.61 | R27.2 R26.2
  Top 0.381: FB1.2 49.86,17.7
  Top 0.406: L1.P$2 48.66,45.77 49.36,45.08 C34.2 50.02,45.06 | 38.02,26.84 C24.1
  Top 0.508: 50.05,45.03 v51.88,45.03 | 34.34,31.7 34.34,27.94 35.42,26.86 C24.1 | 34.34,31.7 35.61,33.48 v37.54,33.48 | LED3.A LED4.A | 50.93,4.61 50.93,7.19 57.12,13.39 57.12,17.53 | 57.12,17.53 57.12,20.02 | Q2.2 22.52,20.07 v20.96,20.07 | v30.35,35.71 33.05,33.02 34.34,31.7 | Q1.2 3.57,38.57 | 41.88,2.25 46.84,2.25 | v56.13,17.53 57.12,17.53 | R35.2 R29.2 | 51.97,45.01 53.85,46.89 55.75,46.89 56.74,47.88 | LED1.A LED2.A 50.18,2.3 50.93,3.05 50.93,4.56
  Bottom 0.254: v51.87,37.44 51.88,37.42 51.88,36.68 | v51.88,35.44 51.94,35.38 52.4,35.38 52.5,35.38 | v66.75,43.59 66.93,43.41 66.93,38.94 v65.76,37.39
  Bottom 0.508: v37.54,33.48 37.54,34.87 38.3,35.64 40.28,37.59 45.8,37.59 48.01,35.38 52.4,35.38 | 57.15,32.74 54.74,35.38 52.5,35.38 | 57.15,32.74 v57.12,26.72 v57.15,23.75 v57.15,20.04 | v51.88,45.03 51.88,36.68 v51.88,35.44 | 57.15,32.74 61.42,32.76 v65.79,32.77 | v20.96,20.07 18.8,17.91 15.29,17.91 13.36,19.84 6.43,19.84 5.28,20.98 2.77,20.98 1.27,22.48 1.27,28.96 6.3,33.98 | 6.3,33.98 6.73,34.42 20.5,34.42 21.79,35.71 v30.35,35.71 | v3.66,38.48 3.66,36.63 6.3,33.98 | v50.04,17.53 v56.13,17.53
3VSWOUT
  Top 0.254: 51.03,48.24 51.36,47.91 L1.P$1 | U10.1 50.53,50.74 51.03,50.24 | U10.3 51.53,50.39 51.03,49.89
  Top 0.406: 51.03,48.24 51.03,48.23
  Top 0.508: U10.2 51.03,50.24 51.03,49.89 51.03,48.24
5V
  Top 0.254: U10.13 49.85,54.17 | 49.86,54.18 51.47,54.18 U10.10 U10.11 U10.12 | 52.81,56.72 C19.1 | 50.53,56.72 C33.1
  Top 0.406: 49.85,54.17 49.86,54.18
  Top 0.508: U10.12 50.53,56.72 52.81,56.72 | C33.1 42.65,56.73 41.66,57.73 J3.2
!AUDIO_RESET  (via drill 0.3)
  Top 0.152: J4.3 63.17,44.27 63.17,46.76
  Top 0.254: U9.4 46.55,28.84 v46.97,28.75 | 35.31,13.51 v35.28,13.66 35.31,13.64 J2.20 | v55.14,33.73 55.14,40.82 53.57,42.39 53.57,43.64 S1.2 53.47,45.31 54.25,46.1 56.9,46.1 58.17,47.37 62.56,47.37 63.17,46.76
  Bottom 0.254: v55.14,33.73 55.02,33.6 51.05,33.63 46.97,29.67 v46.97,28.75 46.97,24.84 v35.28,13.66
!FLASH_CS  (via drill 0.3)
  Top 0.254: U9.42 56.2,27.34 v56.21,27.36 | v56.21,21.97 57.64,23.4 U1.P4 59.28,21.67 !CS.TESTPOINT
  Bottom 0.254: v56.21,27.36 v56.21,21.97
!FLASH_RESET  (via drill 0.3)
  Top 0.254: U9.48 57.57,30.34 v57.99,30.81 | v58.01,24.64 59.23,24.64 U1.P3
  Bottom 0.254: v57.99,30.81 v58.01,24.64
ADC_IN_EXTRN  (via drill 0.3)
  Top 0.254: U9.14 43.38,23.84 v42.93,23.57 | U8.1 34.01,51.41 v34.62,50.8 | 31.15,46.3 R16.2 32.89,46.27 v33.66,45.51 | 32.7,51.86 U8.1 | C13.1 29.1,53.19 32.03,53.19 32.7,52.52 U8.1
  Bottom 0.254: v42.93,23.57 42.93,24.87 42.01,25.78 34.9,25.78 33.22,27.46 33.22,36.27 33.66,36.7 v33.66,45.51 33.66,47.75 34.62,48.72 v34.62,50.8
ADC_IN_MEMS  (via drill 0.3)
  Top 0.254: v40.92,23.8 42.29,23.8 42.85,24.38 46.03,24.38 U9.13 | C12.1 v30.18,23.82 | 30.12,18.56 C12.1 | v29.01,8.89 29.01,11.34 U7.1 | C12.1 30.1,18.43 R15.2 28.4,19.51 v28.6,19.71
  Bottom 0.254: v30.18,23.82 v40.92,23.8 | v28.6,19.71 28.6,9.3 v29.01,8.89
AUDIO_SWDCLK  (via drill 0.3)
  Top 0.152: J4.4 63.12,41.07 63.12,38.58
  Top 0.254: U9.9 40.24,26.34 38.84,24.94 38.84,20.96 v41.38,18.41 | 41.48,18.52 v41.38,18.41 | v36.09,13.18 36.09,7.85 36.73,7.21 36.73,4.9 J2.21 | v56.06,31.77 58.99,31.77 R27.1 62.11,37.58 63.12,38.58 | v55.35,19.89 55.35,17.45 v55.02,16.36 | v43.31,16.87 v41.38,18.41
  Bottom 0.254: v41.38,18.41 41.33,18.41 v36.09,13.18 | v56.06,31.77 55.35,31.06 v55.35,19.89 | 43.66,16.87 43.66,16.94 | 43.66,16.87 54.51,16.87 v55.02,16.36 | 43.66,16.87 v43.31,16.87
AUDIO_SWDIO  (via drill 0.3)
  Top 0.152: J4.2 63.75,41.71 66.62,41.71
  Top 0.254: v66.89,31.65 v66.9,31.65 66.74,31.81 R26.1 66.8,34.96 66.8,41.53 66.62,41.71 | U9.10 40.73,25.84 39.73,24.84 39.73,20.8 40.46,20.07 43.79,20.07 v44.55,19.3 | J2.22 v37.85,12.6
  Bottom 0.254: 67.11,31.65 v66.9,31.65 66.9,27.84 66.95,27.79 66.95,22.84 65.48,21.36 60.58,21.36 58.52,19.3 v44.55,19.3 v37.85,12.6
AUDIO_XIN
  Top 0.254: 45.89,30.34 U9.1 46.07,31.63 46.48,32.04 46.48,33.78 45.96,34.3 X1.3 45.5,35.73 C1.1
AUDIO_XOUT
  Top 0.254: U9.2 45.09,29.84 43.65,31.28 X1.1 43.3,32.75 C2.1
CONTROLLER_BUCK/LDO_N
  Top 0.254: U9.3 45,29.34 41.58,32.77 R10.1 40.53,34.29 R1.2
DBG_GPIO1  (via drill 0.3)
  Top 0.254: U9.57 50.35,30.6 v50.72,30.23
  Bottom 0.254: v50.72,30.23 50.72,30.2 49.89,29.11 48.72,29.11 47.93,28.32 47.93,24.05 30.23,6.35 J2.16
DBG_GPIO2  (via drill 0.3)
  Top 0.254: U9.58 49.85,30.57 v49.35,30.28 | v42.37,19.41 43.23,19.41 44.88,17.76 44.88,16.08 41.35,12.55 41.35,9.75 39.29,7.7 39.29,2.59 38.66,1.96 37.13,1.96 J2.19
  Bottom 0.254: v42.37,19.41 42.42,19.41 47.5,24.49 47.5,28.5 48.46,29.64 49,29.64 v49.35,30.28
DBG_RX  (via drill 0.3)
  Top 0.254: U9.31 53.85,12.47 v53.01,11.63
  Bottom 0.254: J2.18 38.08,11.63 v53.01,11.63
DBG_TX  (via drill 0.3)
  Top 0.254: U9.32 54.35,11.98 v53.01,10.64
  Bottom 0.254: v53.01,10.64 41.15,10.64 36.52,6.88 36.52,5.05 36.4,4.93 34.01,4.93 32.89,3.81 J2.17
FLASH_SCLK  (via drill 0.3)
  Top 0.254: U9.45 55.79,28.84 56.15,28.49 | U1.P2 59.03,25.78 56.82,27.81 56.15,28.49 | v59.16,28.5 56.16,28.5 56.15,28.49 | SCLK.TESTPOINT 63.5,22.2 v63.8,22.5
  Bottom 0.254: v63.8,22.5 63.8,27.81 63.09,28.52 59.18,28.52 v59.16,28.5
FLASH_SI
  Top 0.254: U9.47 57.91,29.84 58.14,30.07 59.46,30.07 | 59.46,30.07 59.82,29.72 59.82,27.54 U1.P1 | SI.TESTPOINT 60.43,31.04 59.46,30.07
FLASH_SO  (via drill 0.3)
  Top 0.254: U9.46 v58.75,29.34 | U1.P8 64.62,27.36 v64.62,29.01 63.86,29.77 SO.TESTPOINT
  Bottom 0.254: v58.75,29.34 64.29,29.34 v64.62,29.01
GND  (via drill 0.3, 2.95 pad 6.35)
  Top 0.152: J4.5 60.91,43.61 59.59,44.93
  Top 0.254: v27.86,43.92 26.71,43.92 C26.1 | v29.16,50.37 29.52,50.72 29.52,52.12 30.12,52.73 31.14,52.73 31.75,52.12 U8.2
  Bottom 0.254: v29.16,50.37 29.16,46.25 v27.86,43.92
  other vias: 54.99,62.23 13.08,62.23 37.64,20.47 57.25,41.33 47.17,8.36 7.32,42.93 18.52,60.71 49.35,61.04 28.91,43.28 20.52,37.24 5.26,24.64 12.98,22.35 37.47,48.64 34.95,38.96 58.09,18.24 51.31,28.96 52.83,28.96 52.83,27.94 51.31,27.94 50.04,27.94 48.77,27.94 48.77,26.67 50.04,26.67 51.31,26.67 52.83,26.67 52.83,25.4 51.31,25.4 50.04,25.4 48.77,25.4 48.77,24.13 50.04,24.13 51.31,24.13 52.83,24.13 66.14,25.96 54.99,3.78 13.08,3.78
  pour Bottom (isolate 0.152, rank 2, no thermals): -2.29,74.42 79.25,74.42 79.25,-7.37 -2.29,-7.37
  pour Top (isolate 0.152, rank 2, no thermals): -2.29,74.93 80.26,74.93 80.26,-10.16 -2.29,-10.16
LEDG1
  Top 0.254: U9.27 51.85,10.82 50.81,9.78 49.67,9.78 R2.1
LEDG2
  Top 0.254: U9.19 47.85,21.48 47.52,21.16 46.02,21.16 45.31,20.45 45.31,11.42 R4.1
LEDR1
  Top 0.254: U9.28 52.35,9.84 51.12,8.61 49.86,8.61 48.54,7.29 R3.1
LEDR2
  Top 0.254: U9.20 48.35,21.3 47.62,20.57 46.25,20.57 45.95,20.27 45.95,8.83 R5.1
MOD_IN
  Top 0.254: U9.51 53.35,40.44 53.29,40.44 52.68,41.05 49.35,41.05 45.26,45.14 45.26,50.67 42.55,53.39 38.48,53.39 32.84,59.03 32.13,59.03 J3.10
MOD_OUT
  Top 0.254: U9.50 53.85,40.62 52.98,41.48 49.81,41.48 45.95,45.34 45.95,50.8 42.65,54.1 38.84,54.1 34.04,58.9 J3.8
N87  (via drill 0.3)
  Top 0.254: R28.2 C6.1 21.08,50.66 U6.1 21.2,49.49 v21.64,49.05 | TP10.TESTPOINT C9.2 16.55,47.13 15.8,47.88 15.8,50.12 R28.2 | 16.56,50.66 R28.2 | 28.82,45.03 28.22,45.03 25.98,47.27 v25.98,47.45 | P2.3 16.01,50.33 R28.2 | 28.89,45.03 28.82,45.03 | 28.82,45.03 R9.1
  Bottom 0.254: v21.64,49.05 24.82,49.05 v25.98,47.45
N90
  Top 0.254: 16.7,18.59 C10.2 | TP9.TESTPOINT C10.2 | R25.2 C5.1 19.42,14.25 U5.1 16.7,14.29 18.24,15.82 18.24,17.86 17.86,18.24 17.18,18.24 C10.2 | R25.2 22.07,14.11 P1.3 | R25.2 22.88,15.4 R8.1
N$1
  Top 0.254: C15.1 U3.6
N$2
  Top 0.254: U3.8 R32.2 C3.1
N$3
  Top 0.254: C9.1 U3.5
N$5
  Top 0.254: C7.1 19.09,7.31 | 19.09,7.31 20.41,5.98 R13.2 | C30.2 19.28,7.31 19.09,7.31
N$6
  Top 0.254: C4.1 R33.2 20.69,25.37 16.23,25.37 U4.8
N$7
  Top 0.254: C10.1 15.48,19.95 14.38,21.06 11.45,21.06 U4.5
N$8
  Top 0.254: U8.4 29.16,48.81 | 29.16,48.81 29.11,48.81 28.45,49.48 28.45,51.24 C13.2 | R9.2 29.16,46.47 | 29.16,46.47 29.16,48.81 | 29.16,46.47 30.66,44.97 R16.1
N$9
  Top 0.254: R18.1 C25.2 11.94,15.91 R17.2 14.69,14.37 U5.3
N$10
  Top 0.254: R11.2 29.82,55.79 R12.2 25.53,55.79 R14.1
N$11
  Top 0.254: R20.1 C26.2 | R19.2 R20.1 | U6.3 23.1,46.59 R20.1
N$12  (via drill 0.3)
  Top 0.254: 25.22,9.43 P1.2 | 25.11,9.22 P1.2 | v16.05,10.41 16.04,10.41 U5.4 14.8,7.6 14.82,7.6 15.15,7.27 R6.2 | v18.39,12.24 18.99,12.24 C5.2 R25.1 21.59,12.74 P1.2
  Bottom 0.254: v16.05,10.41 16.56,10.41 v18.39,12.24
N$13
  Top 0.254: R6.1 17.46,8.57 19.25,10.36 21.02,10.36 C30.1
N$14
  Top 0.254: P2.2 15.14,53.58 R28.1 C6.2 18.8,54.23 19.46,54.89 21.35,54.89 U6.4 23.1,51.83 23.52,51.41 24.45,51.41 R7.2
N$15
  Top 0.254: R7.1 C31.1
N$16  (via drill 0.3)
  Top 0.254: R12.1 28.18,53.65 33.02,53.65 v35.48,51.18 | v41.12,42.93 J1.1
  Bottom 0.254: v35.48,51.18 35.48,48.56 v41.12,42.93
N$17
  Top 0.254: R11.1 36.62,54.52 38.2,52.93 39.29,52.93 40.32,51.91 J1.4
N$18  (via drill 0.3)
  Top 0.254: v23.6,7.65 21.09,7.65 R13.1
  Bottom 0.254: v23.6,7.65 23.98,7.26 U2.1
N$19  (via drill 0.3)
  Top 0.254: C17.1 2.79,24.16 v3.99,22.96
  Bottom 0.254: v3.99,22.96 8.74,22.96 U4.6
N$20  (via drill 0.3)
  Top 0.254: v26.21,53.8 25.97,53.8 R14.2 25.25,54.57 C8.1 | C31.2 26.44,49.94 v26.31,49.07
  Bottom 0.254: v26.21,53.8 26.31,53.7 v26.31,49.07
N$21
  Top 0.254: R2.2 LED1.C
N$23
  Top 0.254: R3.2 48.54,3.77 LED2.C
N$24  (via drill 0.3)
  Top 0.254: 46.04,24.82 U9.12 41.91,24.84 v41.78,24.71
  Bottom 0.254: TP8.TESTPOINT 28.17,24.41 41.4,24.41 v41.78,24.71
N$25
  Top 0.254: R5.2 LED4.C
N$26
  Top 0.254: U7.4 30.18,14.67 C12.2 30.1,17.13 R15.1 25.55,17.13 R8.2
N$27
  Top 0.254: C28.2 R21.1 33.98,14.64 33.98,12.6 32.76,11.38 U7.3 | 32.46,17.03 R22.2 32.16,16.72 C28.2 | 32.24,14.94 C28.2
N$28
  Top 0.254: C29.2 R23.2 36.02,47.56 36.02,50.11 | 36.02,50.11 37.38,51.48 R24.1 | U8.3 30.8,50.43 31.14,50.09 35.99,50.09 36.02,50.11
N$29
  Top 0.254: U9.5 45.06,28.34 43.26,30.15 C20.1 41.19,30.62 C32.1 39.84,30.92 L2.P$2
N$32
  Top 0.254: 50.85,20.92 U9.25 | 50.85,20.92 50.85,20.53 C21.1 49.42,20.03 FB1.1 | U9.24 50.35,21.42 50.85,20.92
N$33
  Top 0.254: R4.2 LED3.C
N$34
  Top 0.406: U10.9 52.6,54.24
  Top 0.508: 52.6,54.24 C14.2
N$36
  Top 0.254: U10.4 52.05,51.38 52.05,50.32 53.98,48.39 R29.1
N$37
  Top 0.254: R35.1 R34.2 55.46,52.06 U10.5
N$44
  Top 0.254: L2.P$1 37.41,28.45 39.37,28.45 40.47,27.34 U9.7
N$53
  Top 0.254: U9.37 55.55,24.84 55.7,24.69 55.36,24.34 U9.36
N$54
  Top 0.254: U9.34 55.6,23.34 55.8,23.14 55.51,22.84 U9.33
PPS
  Top 0.254: U9.49 54.35,40.83 53.16,42.01 50.14,42.01 46.89,45.26 46.89,50.7 42.75,54.84 39.34,54.84 35.38,58.8 35.38,60.94 34.11,62.21 J3.7
SCL  (via drill 0.3)
  Top 0.254: U9.60 48.85,35.82 v49.3,36.27 | v43.05,57.73 43.05,62.81 v42.19,63.68
  Bottom 0.254: v49.3,36.27 49.3,42.44 46.33,45.41 46.33,50.32 46.3,50.34 46.3,57.23 45.8,57.73 v43.05,57.73 | v42.19,63.68 38.18,63.68 36.73,62.23 36.6,62.23 J3.5
SDA  (via drill 0.3)
  Top 0.254: U9.59 49.35,34.62 v50.8,36.32
  Bottom 0.254: v50.8,36.32 50.8,41.94 47.19,45.54 47.19,57.2 43.69,60.71 37.59,60.71 36.58,59.69 J3.6
SPEC2_GATED  (via drill 0.3)
  Top 0.254: U3.1 9.51,35.67 C16.1 7.75,37.07 7.75,39.62 6.48,40.89 Q1.3 5.67,44.23 v7.19,45.74 8.57,47.13 R32.1 | 19.03,45.84 v19.03,45.77 19.8,44.99 R19.1 | v19.74,53.65 20.7,53.65 U6.5 | v33.86,48.95 33.73,48.81 U8.5 33.93,47.59 R23.1
  Bottom 0.254: v7.19,45.74 19,45.74 v19.03,45.77 19.03,48.08 19.53,48.59 19.53,53.44 v19.74,53.65 19.96,53.87 19.96,56.41 20.93,57.38 23.95,57.38 24.61,56.72 31.34,56.72 33.86,54.2 v33.86,48.95
SPEC2_OUT  (via drill 0.3)
  Top 0.254: U9.16 43.93,22.84 v42.9,21.82 | v29.23,22.5 29.23,29.44 TP2.TESTPOINT 25.02,31.95 24,32.97 17.58,32.97 U3.3
  Bottom 0.254: v42.9,21.82 34.44,21.82 33.66,22.5 v29.23,22.5
SPEC2_POWER  (via drill 0.3)
  Top 0.254: v41.33,14.73 39.95,14.73 32.94,21.74 32.94,29.29 32.31,29.92 28.09,34.14 28.09,35.31 TP4.TESTPOINT | U9.26 51.35,14.85 v51.23,14.73 | v6.5,38.79 5.37,38.79 R30.1 2.98,36.97 1.98,37.97 1.98,40.25 Q1.1
  Bottom 0.254: v51.23,14.73 v41.33,14.73 | TP4.TESTPOINT 23.65,38.79 v6.5,38.79
SPEC2_RESET  (via drill 0.3)
  Top 0.254: v42.67,16.28 39.4,16.28 33.5,22.17 33.5,30.25 28.7,35.05 28.7,36.27 26.37,38.61 TP3.TESTPOINT | v49.61,16.23 48.01,16.23 | 48.01,16.23 47.85,16.23 | U9.22 49.3,22.02 49.3,20.6 48.26,19.56 47.24,19.56 46.99,19.3 46.99,17.25 48.01,16.23
  Bottom 0.254: v49.61,16.23 42.72,16.23 v42.67,16.28 | U3.7 16.05,39.57 TP3.TESTPOINT
SPEC2_STROBE  (via drill 0.3)
  Top 0.254: v40.39,13.82 39.65,14.05 31.93,21.77 31.93,29.54 28.52,32.94 27.71,32.94 26.37,34.29 TP5.TESTPOINT 18.59,34.49 U3.4 | v49.05,13.87 47.32,13.87 46.43,14.76 46.43,19.61 46.66,20.09 47.9,20.09 48.79,20.98 48.79,22.02 U9.21
  Bottom 0.254: v49.05,13.87 40.31,13.82 v40.39,13.82
SPEC_GATED  (via drill 0.3)
  Top 0.254: U4.1 17.16,30.59 C18.1 R33.1 19.75,26.81 v18.95,26.01 | C27.2 C11.2 22.53,5.79 v22.81,6.07 | v18.57,10.92 17.43,10.92 U5.5 16.7,9.89 v16.43,9.63 | v20.88,16.79 21.25,17.16 Q2.3 20.04,18.29 v18.97,19.36 | v25.02,14.38 25.42,13.98 U7.5 28.97,15.71 v29.23,15.98 | v11.94,11.3 R17.1 | v31.39,19.61 31.64,19.61 R22.1
  Bottom 0.254: U2.2 24.88,6.07 v22.81,6.07 22.81,6.68 v18.57,10.92 20.88,13.23 v20.88,16.79 23.29,14.38 v25.02,14.38 | v16.43,9.63 13.61,9.63 v11.94,11.3 | v18.97,19.36 18.97,25.98 v18.95,26.01 | v29.23,15.98 30.71,15.98 31.29,16.56 31.29,19.51 v31.39,19.61
SPEC_OUT  (via drill 0.3)
  Top 0.254: v40.36,22.89 43.13,22.89 43.54,23.29 46.02,23.29 U9.15 | TP1.TESTPOINT 27.15,29.41 27.99,28.88 27.99,23.42 v28.27,23.14
  Bottom 0.254: v28.27,23.14 33.68,23.14 34.7,22.28 39.75,22.28 v40.36,22.89 | TP1.TESTPOINT 22.86,29.41 22.4,30.2 12.47,30.2 U4.3
SPEC_POWER
  Top 0.254: Q2.1 24.44,17.34 R31.1
SPEC_RESET  (via drill 0.3)
  Top 0.203: TP7.TESTPOINT 23.37,21.34 16.26,21.34 U4.7
  Top 0.254: U9.11 41.12,25.34 v40.95,25.17
  Bottom 0.254: v40.95,25.17 27.36,25.32 TP7.TESTPOINT
SPEC_STROBE  (via drill 0.3)
  Top 0.254: U9.30 53.35,13.32 v53.06,13.03 | v39.55,13.28 39.32,13.28 31.19,21.41 31.19,26.11 v30.56,26.75
  Bottom 0.254: v53.06,13.03 39.8,13.03 v39.55,13.28 | v30.56,26.75 30.28,26.9 TP6.TESTPOINT 24.46,26.85 22.1,29.46 10.67,29.46 U4.4
USB+  (via drill 0.3)
  Top 0.254: U9.63 47.35,37.11 v46.58,37.87 | v30.89,58.01 30.25,58.65 30.25,60.53 28.96,61.82 J3.11
  Bottom 0.254: v46.58,37.87 46.58,43.28 44.88,44.98 44.88,50.47 42.39,52.96 38.23,52.96 33.22,57.96 30.94,57.96 v30.89,58.01
USB-  (via drill 0.3)
  Top 0.254: U9.62 v47.85,38.13
  Bottom 0.254: v47.85,38.13 47.85,43.06 45.64,45.26 45.64,50.67 42.65,53.67 38.79,53.67 33.86,58.6 30.02,58.6 J3.12

### Text on the board
tPlace: USB+ | SCL | PPS | GND | USB- | MOD_IN | MOD_OUT | SDA | 3V3 | 5V | R24 - Fixed gain / P2 - Adj gain / Choose one | Mic | E | Reset / Button | RESET | External Mic | POWER | Choose / Internal / Reg | LDO | Audio / Spectrum / Analyzer | STROBE | SWITCH | OUT | OUT | STROBE | On-Board Mic | RESET | POWER | Mic | R21 - Fixed gain / P1 - Adj gain / Choose one | DBG_GPIO1 | DBG_RX | !RESET | SWDIO | Mic / Port | GND | DBG_TX | DBG_GPIO2 | SWDCLK
tNames: Gain Adj. / 3x-133x / (6bB-42dB) / CCW+,CW- | SAM4L / Programmer | 9/2017 | MIC Input | Samuel Rohrer / Joshua Adkins | Gain Adj. / 3x-133x / (6bB-42dB) / CCW+,CW-
Measures: 0.358 / 9.10 Below PCB | 0.1 / 2.54 Above PCB
Reference: Drill 0.116 @ (-0.825, 1.15) | Drill 0.116 @ (0.825, 1.15) | GND | GND | Drill 0.116 @ (-0.825, -1.15) | Drill 0.116 @ (0.825, -1.15) | GND | GND